# Altium project ACTIVIEW-HEADSET-PCB.PrjPcb
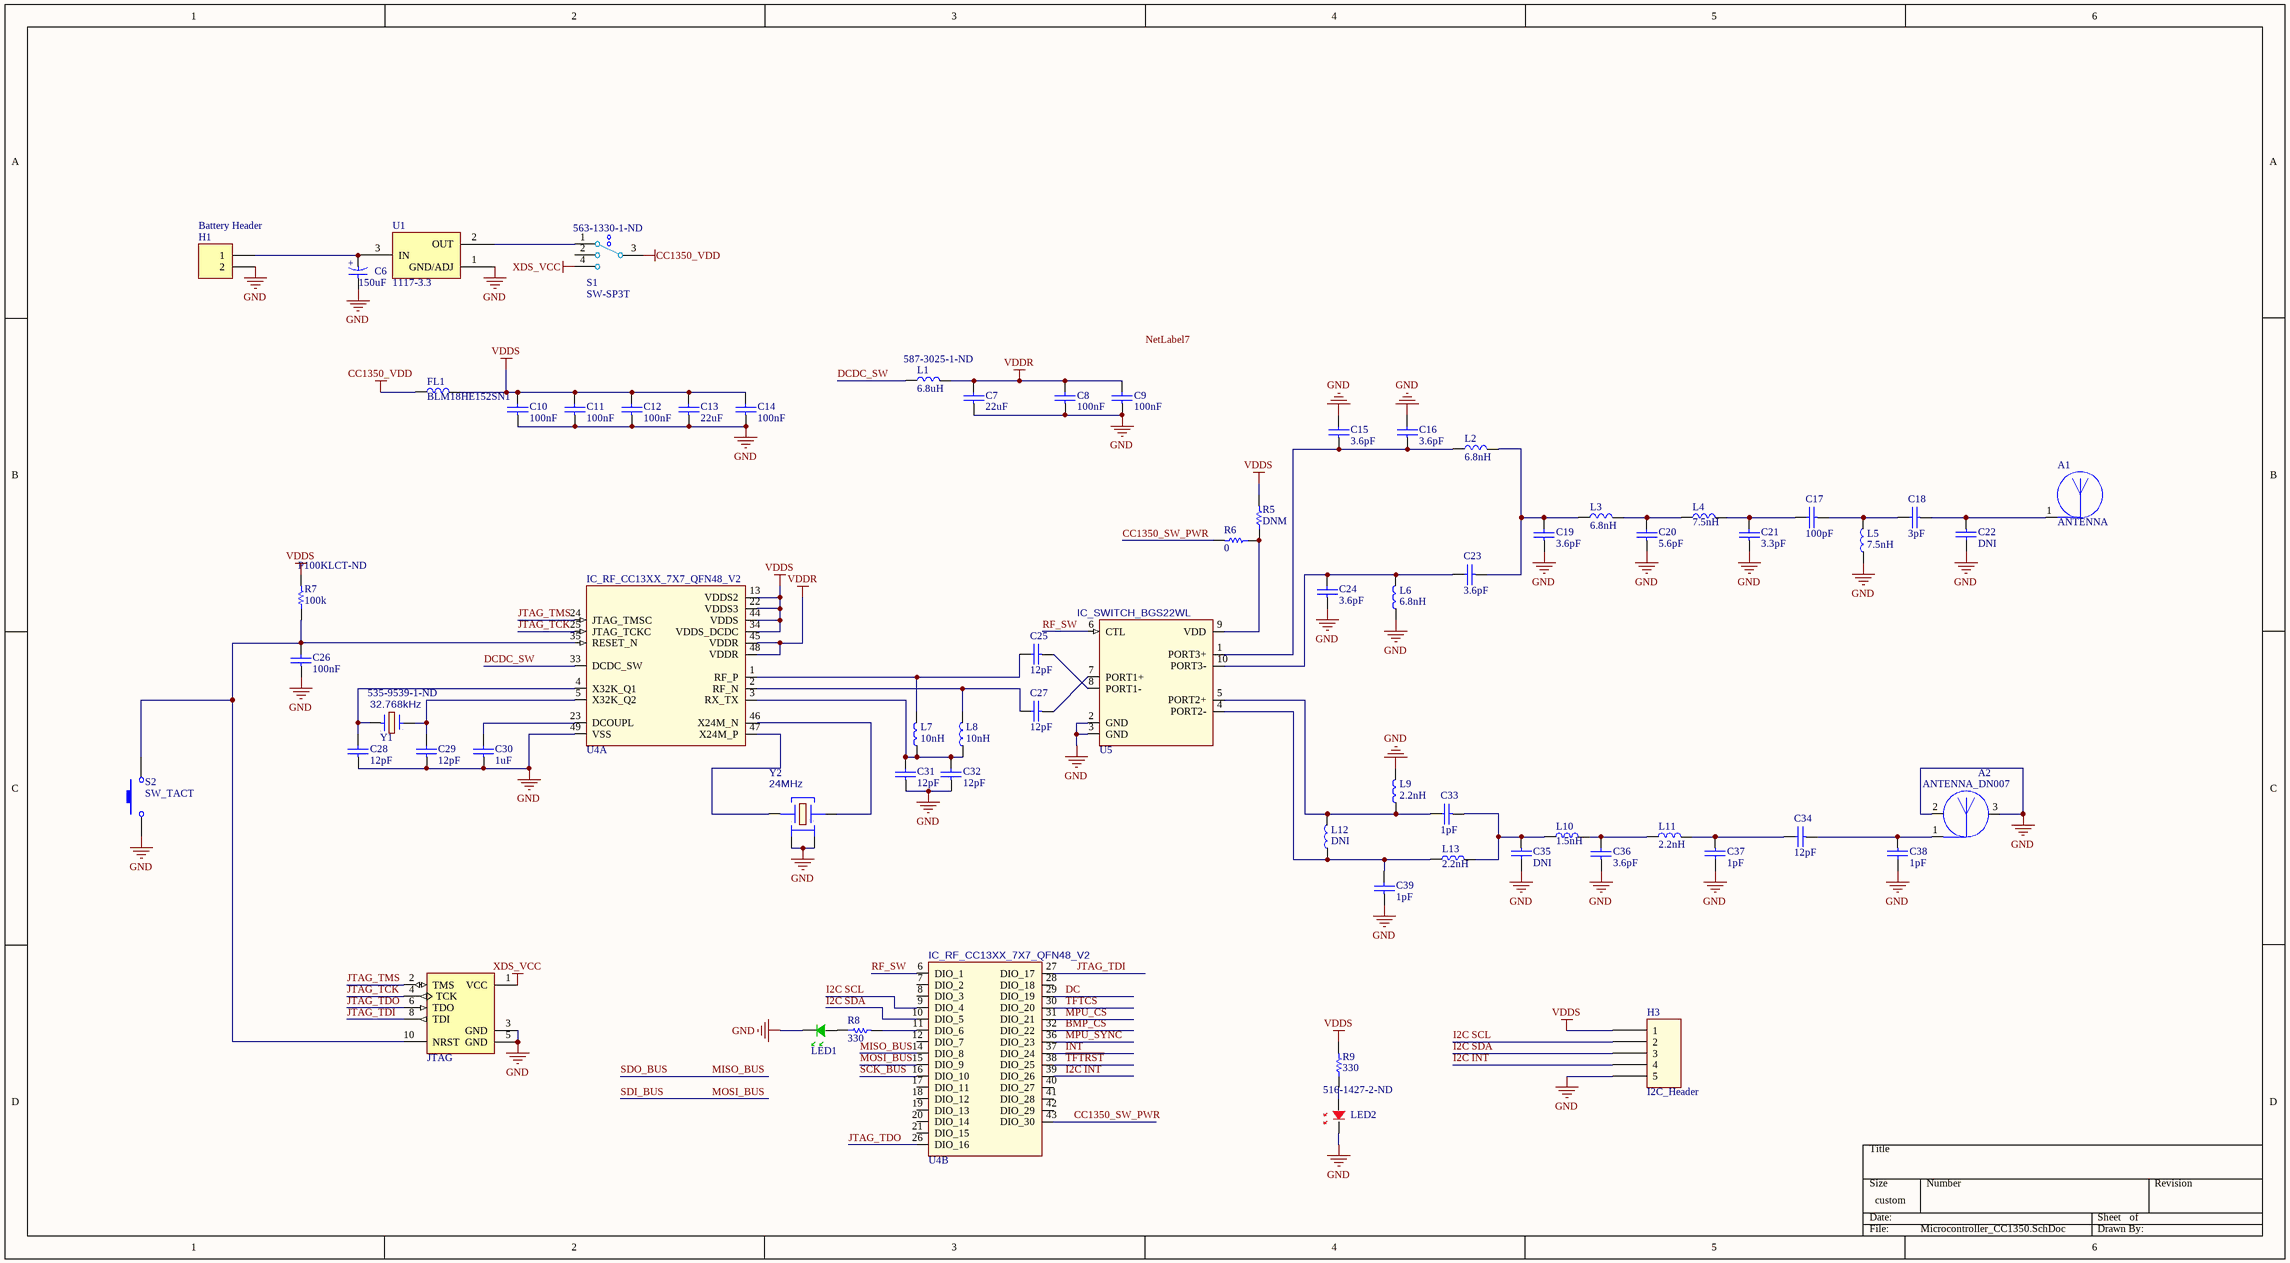
[diagram p0: Microcontroller_CC1350.SchDoc]
4 sheets, 75 parts. Net scope: global (net labels, ports and power ports of the same name join across sheets).
Board file: HEADSET-PCB.PcbDoc
Sheets:
  Microcontroller_CC1350.SchDoc
  IMU_MPU9250.SchDoc
  Pressure_BMP280.SchDoc
  LCD_Display.SchDoc

## Sheet Microcontroller_CC1350.SchDoc
size 508 x 279 mm

### Parts
A1  ANTENNA  [Sub-1GHz-Antenna]
A2  ANTENNA_DN007  [Inverted_F_Antenna]
C6  150uF  [2312 [IMP] Polar]
C7  22uF  [0603[IMP]]
C8  100nF  [0402[IMP]]
C9  100nF  [0402[IMP]]
C10  100nF  [0402[IMP]]
C11  100nF  [0402[IMP]]
C12  100nF  [0402[IMP]]
C13  22uF  [0603[IMP]]
C14  100nF  [0402[IMP]]
C15  3.6pF  [0402[IMP]]
C16  3.6pF  [0402[IMP]]
C17  100pF  [0402[IMP]]
C18  3pF  [0402[IMP]]
C19  3.6pF  [0402[IMP]]
C20  5.6pF  [0402[IMP]]
C21  3.3pF  [0402[IMP]]
C22  DNI  [0402[IMP]]
C23  3.6pF  [0402[IMP]]
C24  3.6pF  [0402[IMP]]
C25  12pF  [0402[IMP]]
C26  100nF  [0402[IMP]]
C27  12pF  [0402[IMP]]
C28  12pF  [0402[IMP]]
C29  12pF  [0402[IMP]]
C30  1uF  [0402[IMP]]
C31  12pF  [0402[IMP]]
C32  12pF  [0402[IMP]]
C33  1pF  [0402[IMP]]
C34  12pF  [0402[IMP]]
C35  DNI  [0402[IMP]]
C36  3.6pF  [0402[IMP]]
C37  1pF  [0402[IMP]]
C38  1pF  [0402[IMP]]
C39  1pF  [0402[IMP]]
FL1  BLM18HE152SN1  [0603[IMP]]
H1  Battery Header  [S2B-PH-SM4-TB]
H2  JTAG  [HDR-2*5-0.05_Without_Through_Hole]
H3  I2C_Header  [I2C_Header]
L1  Supplier Part Number 1: 587-3025-1-ND  [0805[IMP]]  (hidden comment: 6.8uH)
L2  6.8nH  [0402[IMP]]
L3  6.8nH  [0402[IMP]]
L4  7.5nH  [0402[IMP]]
L5  7.5nH  [0402[IMP]]
L6  6.8nH  [0402[IMP]]
L7  10nH  [0402[IMP]]
L8  10nH  [0402[IMP]]
L9  2.2nH  [0402[IMP]]
L10  1.5nH  [0402[IMP]]
L11  2.2nH  [0402[IMP]]
L12  DNI  [0402[IMP]]
L13  2.2nH  [0402[IMP]]
LED1  LEDG  [0805[IMP] - POLAR]  (value not drawn)
LED2  Supplier Part Number 1: 516-1427-2-ND  [0805[IMP] - POLAR]  (hidden comment: LEDR)
R5  DNM  [0402[IMP]]
R6  0  [0402[IMP]]
R7  100k  Supplier Part Number 1: P100KLCT-ND  [0402[IMP]]
R8  330  [0402[IMP]]
R9  330  [0402[IMP]]
S1  SW-SP3T  Supplier Part Number 1: 563-1330-1-ND  [CL-SB-13B]
S2  SW_TACT  [PTS645SH50SMTR92_LFS]
U1  1117-3.3  [SOT-223]
U4  IC_RF_CC13XX_7X7_QFN48_V2  [RGZ(S-PVQFN-N48) - duplicate]  (parts A,B of 2)
U5  IC_SWITCH_BGS22WL  [TSLP-10-1]
Y1  32.768kHz  Supplier Part Number 1: 535-9539-1-ND  [FC-135]
Y2  24MHz  [TSX-3225]

### Nets
CC1350_VDD: FL1.1 S1.3
GND: A2.2(GND_2) A2.3(GND_3) C6.1 C7.2 C8.2 C9.2 C10.2 C11.2 C12.2 C13.2 C14.2 C15.1 C16.1 C19.2 C20.2 C21.2 C22.1 C24.2 C26.2 C28.2 C29.2 C30.2 C31.2 C32.2 C35.1 C36.2 C37.1 C38.1 C39.2 H1.2 H2.3(GND) H2.5(GND) H3.5 L5.1 L6.1 L9.2 LED1.2(K) LED2.2(K) S2.1 U1.1(GND/ADJ) U4.49(VSS) U5.2(GND) U5.3(GND) Y2.2 Y2.4
VDDR: C7.1 C8.1 C9.1 L1.2 U4.45(VDDR) U4.48(VDDR)
VDDS: C10.1 C11.1 C12.1 C13.1 C14.1 FL1.2 H3.1 R5.2 R7.2 R9.2 U4.13(VDDS2) U4.22(VDDS3) U4.34(VDDS_DCDC) U4.44(VDDS)
XDS_VCC: H2.1(VCC) S1.4
BMP_CS: U4.32(DIO_22)
CC1350_SW_PWR: R6.2 U4.43(DIO_30)
DC: U4.29(DIO_19)
DCDC_SW: L1.1 U4.33(DCDC_SW)
I2C INT: H3.4 U4.39(DIO_26)
I2C SCL: H3.2 U4.9(DIO_4)
I2C SDA: H3.3 U4.10(DIO_5)
INT: U4.37(DIO_24)
JTAG_TCK: H2.4(TCK) U4.25(JTAG_TCKC)
JTAG_TDI: H2.8(TDI) U4.27(DIO_17)
JTAG_TDO: H2.6(TDO) U4.26(DIO_16)
JTAG_TMS: H2.2(TMS) U4.24(JTAG_TMSC)
MISO_BUS: U4.14(DIO_8)  [also labelled SDO_BUS]
MOSI_BUS: U4.15(DIO_9)  [also labelled SDI_BUS]
MPU_CS: U4.31(DIO_21)
MPU_SYNC: U4.36(DIO_23)
RF_SW: U4.6(DIO_1) U5.6(CTL)
SCK_BUS: U4.16(DIO_10)
~{TFTRST}: U4.38(DIO_25)
TFTCS: U4.30(DIO_20)
NetA1_1: A1.1(FEED/GND_1) C18.2 C22.2
NetA2_1: A2.1(FEED_1) C34.2 C38.2
NetC6_2: C6.2 H1.1 U1.3(IN)
NetC15_2: C15.2 C16.2 L2.1 U5.1(PORT3+)
NetC17_1: C17.1 C21.1 L4.2
NetC17_2: C17.2 C18.1 L5.2
NetC19_1: C19.1 C23.2 L2.2 L3.1
NetC20_1: C20.1 L3.2 L4.1
NetC23_1: C23.1 C24.1 L6.2 U5.10(PORT3-)
NetC25_1: C25.1 L7.2 U4.1(RF_P)
NetC25_2: C25.2 U5.8(PORT1-)
NetC26_1: C26.1 H2.10(NRST) R7.1 S2.2 U4.35(RESET_N)
NetC27_1: C27.1 L8.2 U4.2(RF_N)
NetC27_2: C27.2 U5.7(PORT1+)
NetC28_1: C28.1 U4.4(X32K_Q1) Y1.1
NetC29_1: C29.1 U4.5(X32K_Q2) Y1.2
NetC30_1: C30.1 U4.23(DCOUPL)
NetC31_1: C31.1 C32.1 L7.1 L8.1 U4.3(RX_TX)
NetC33_1: C33.1 L9.1 L12.2 U5.5(PORT2+)
NetC33_2: C33.2 C35.2 L10.1 L13.2
NetC34_1: C34.1 C37.2 L11.2
NetC36_1: C36.1 L10.2 L11.1
NetC39_1: C39.1 L12.1 L13.1 U5.4(PORT2-)
NetLED1_1: LED1.1(A) R8.1
NetLED2_1: LED2.1(A) R9.1
NetR5_1: R5.1 R6.1 U5.9(VDD)
NetR8_2: R8.2 U4.11(DIO_6)
NetS1_1: S1.1 U1.2(OUT)
NetU4_46: U4.46(X24M_N) Y2.3
NetU4_47: U4.47(X24M_P) Y2.1

Not connected (* = marked no-connect by the designer): S1 2; U4 7(DIO_2) 8(DIO_3) 12(DIO_7) 17(DIO_11) 18(DIO_12) 19(DIO_13) 20(DIO_14) 21(DIO_15) 28(DIO_18) 40(DIO_27) 41(DIO_28) 42(DIO_29)

### Notes on the sheet
- Labels drawn without touching a wire or pin: NetLabel7
- (in symbol Cap_E) +

### Library data of the parts
A1 = ANTENNA: Designed by: Pawel Kwaskiewicz; CLASS: DISCRETE; Design date: 2010-02-22
A2 = ANTENNA_DN007: Designed by: Artur Bielinski; Design date: 2011-09-19
C6 = Cap_E: Capacitor; Value: 150uF; Supplier 1: Digi-Key; Supplier Part Number 1: 478-3481-1-ND
C7-C39 = CAPACITOR: VOLTAGE: CMAX; CURRENT: CIMAX; KNEE: CBMAX; PSpiceTemplate: C^@REFDES %1 %2 ?TOLERANCE|C^@REFDES| @VALUE ?IC/IC=@IC/ TC=@TC1,@TC2 ?TOLERANCE|\n.model C^@REFDES CAP C=1 DEV=@TOLERANCE%|; DIST: FLAT; SLOPE: CSMAX; MAX_TEMP: CTMAX; TC1: 0; CLASS: DISCRETE; TC2: 0
  C7 C13: Value: 22uF; Supplier 1: Digi-Key; Supplier Part Number 1: 490-7611-1-ND
  C8-C12 C14 C26: Value: 100nF; Supplier 1: Digi-Key; Supplier Part Number 1: 490-6327-1-ND
  C15 C19 C23 C24 C36: Value: 3.6pF; Supplier 1: Digi-Key; Supplier Part Number 1: 490-5939-1-ND
  C16: Value: 3.6pF; Supplier 1: Digi-Key; Supplier Part Number 1: 399-14982-1-ND; Supplier 2: Digi-Key; Supplier Part Number 2: 490-5939-1-ND
  C17: Value: 100pF; Supplier 1: Digi-Key; Supplier Part Number 1: 490-7753-1-ND
  C18: Value: 3pF; Supplier 1: Digi-Key; Supplier Part Number 1: 712-1282-1-ND
  C20: Value: 5.6pF; Supplier 1: Digi-Key; Supplier Part Number 1: 490-6250-1-ND
  C21: Value: 3.3pF; Supplier 1: Digi-Key; Supplier Part Number 1: 490-5938-1-ND
  C22 C35: Value: DNI
  C25 C27-C29 C31 C32: Value: 12pF; Supplier 1: Digi-Key; Supplier Part Number 1: 399-1013-1-ND
  C30: Value: 1uF; Supplier 1: Digi-Key; Supplier Part Number 1: 1276-1448-1-ND
  C33 C37-C39: Value: 1pF; Supplier 1: Digi-Key; Supplier Part Number 1: 490-3199-1-ND
  C34: Value: 12pF; Supplier 1: Digi-Key; Supplier Part Number 1: 490-5924-1-ND
FL1 L1-L13 = INDUCTOR: Current: LMAX; PSpiceTemplate: L^@REFDES %1 %2 ?TOLERANCE|L^@REFDES| @VALUE ?IC/IC=@IC/ ?TOLERANCE|\n.model l^@REFDES IND L=1 DEV=@TOLERANCE%|; DIELECTRIC: DSMAX; DIST: FLAT
  FL1: Value: BLM18HE152SN1; Supplier 1: Digi-Key; Supplier Part Number 1: 490-5216-1-ND
  L1: Value: 6.8uH; Supplier 1: Digi-Key
  L2 L6: Value: 6.8nH; Supplier 1: Digi-Key; Supplier Part Number 1: 712-1419-1-ND
  L3: Value: 6.8nH; Supplier 1: Digi-Key; Supplier Part Number 1: 587-1543-1-ND
  L4 L5: Value: 7.5nH; Supplier 1: Digi-Key; Supplier Part Number 1: 490-3456-1-ND
  L7 L8: Value: 10nH; Supplier 1: Digi-Key; Supplier Part Number 1: 712-1407-1-ND
  L9 L11 L13: Value: 2.2nH; Supplier 1: Digi-Key; Supplier Part Number 1: 490-6794-1-ND
  L10: Value: 1.5nH; Supplier 1: Digi-Key; Supplier Part Number 1: 490-6783-1-ND
  L12: Value: DNI
H1 = Header 2: Supplier 1: Digi-Key; Supplier Part Number 1: 455-1749-1-ND
H2 = JTAG-ARM: USB JTAG Programmer; Supplier 1: Digi-Key; Supplier Part Number 1: SAM13160CT-ND
LED1 = LED_G: LED; Value: ?; Supplier 1: Digi-Key; Supplier 2: Digi-Key; Supplier Part Number 2: 475-1410-1-ND
LED2 = LED_R: LED; Value: ?; Supplier 1: Digi-Key
R5-R9 = RESISTOR
  R5: Value: DNM
  R6: Value: 0; Supplier 1: Digi-Key; Supplier Part Number 1: 541-0.0YBCT-ND
  R7: Value: 100k; Supplier 1: Digi-Key
  R8 R9: Value: 330; Supplier 1: Digi-Key; Supplier Part Number 1: P330LCT-ND
S2 = SW_TACT: Tactile switch; Supplier 1: Digi-Key; Supplier Part Number 1: CKN9085CT-ND
U1 = 1117-3.3V: 3.3V Voltage Regulator; Supplier 1: Digi-Key; Supplier Part Number 1: LM1117IMPX-3.3/NOPBCT-ND
U4 = IC_RF_CC13XX_7X7_QFN48_V2: Designed_By: Artur Bielinski; SPLIT_INST: TRUE; SWAP_INFO: (S1+S2); Design_Date: 2014-09-04; Supplier 1: Digi-Key; Supplier Part Number 1: 296-44716-1-ND
U5 = IC_SWITCH_XMSSJE3G0PA-00: CLASS: IC; Designed_By: Artur Bielinski; Design_Date: 2015-06-03; Supplier 1: Digi-Key; Supplier Part Number 1: BGS22WL10E6327XTSA1CT-ND
Y1 = CRYSTAL: Supplier 1: Digi-Key
Y2 = XTAL_4PIN_S: Supplier 1: Digi-Key; Supplier Part Number 1: SER3635CT-ND
S1 = SW-SP3T: Supplier 1: Digi-Key

## Sheet IMU_MPU9250.SchDoc
size 203 x 127 mm
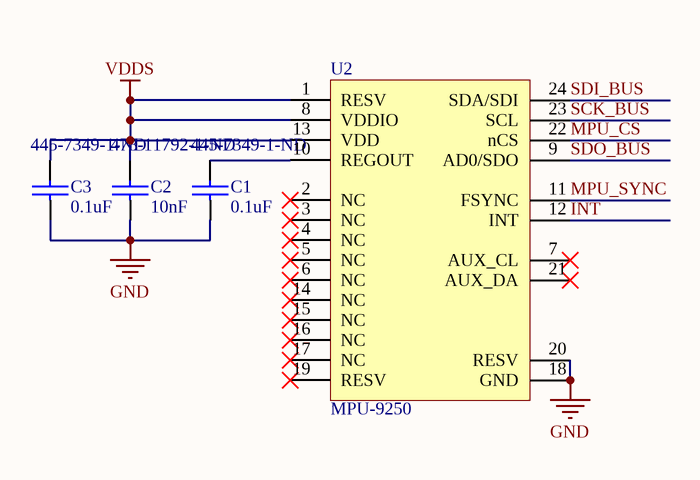
[diagram p1: IMU_MPU9250.SchDoc]

### Parts
C1  Supplier Part Number 1: 445-7349-1-ND  [0402[IMP]]  (hidden comment: 0.1uF)
C2  Supplier Part Number 1: 478-11792-1-ND  [0402[IMP]]  (hidden comment: 10nF)
C3  Supplier Part Number 1: 445-7349-1-ND  [0402[IMP]]  (hidden comment: 0.1uF)
U2  MPU-9250  [QFN-24-3mmx3mm]

### Nets
GND: C1.2 C2.2 C3.2 U2.18(GND) U2.20(RESV)
VDDS: C2.1 C3.1 U2.1(RESV) U2.8(VDDIO) U2.13(VDD)
INT: U2.12(INT)
MPU_CS: U2.22(nCS)
MPU_SYNC: U2.11(FSYNC)
SCK_BUS: U2.23(SCL)
SDI_BUS: U2.24(SDA/SDI)  [project net MOSI_BUS]
SDO_BUS: U2.9(AD0/SDO)  [project net MISO_BUS]
NetC1_1: C1.1 U2.10(REGOUT)

Not connected (* = marked no-connect by the designer): U2 2(NC)* 3(NC)* 4(NC)* 5(NC)* 6(NC)* 7(AUX_CL)* 14(NC)* 15(NC)* 16(NC)* 17(NC)* 19(RESV)* 21(AUX_DA)*

### Library data of the parts
C1-C3 = CAPACITOR: as C7 on sheet Microcontroller_CC1350; TC2: 0; Supplier 1: Digi-Key
  C1 C3: Value: 0.1uF
  C2: Value: 10nF

## Sheet Pressure_BMP280.SchDoc: BMP280
size 203 x 127 mm
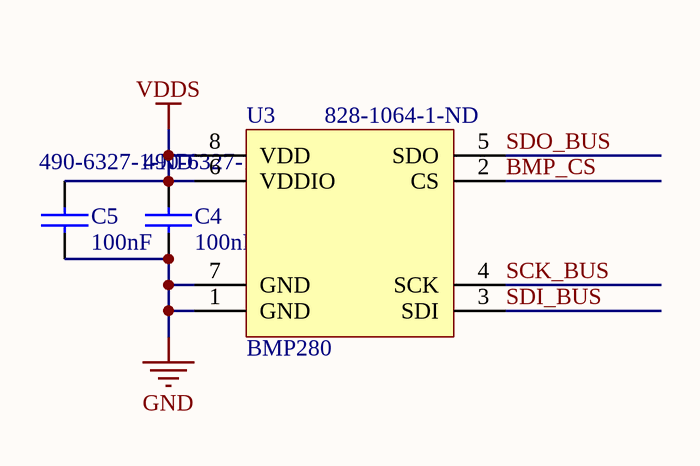
[diagram p2: Pressure_BMP280.SchDoc]

### Parts
C4  Supplier Part Number 1: 490-6327-1-ND  [0402[IMP]]  (hidden comment: 100nF)
C5  Supplier Part Number 1: 490-6327-1-ND  [0402[IMP]]  (hidden comment: 100nF)
U3  BMP280  Supplier Part Number 1: 828-1064-1-ND  [LGA-8]

### Nets
GND: C4.2 C5.2 U3.1(GND) U3.7(GND)
VDDS: C4.1 C5.1 U3.6(VDDIO) U3.8(VDD)
BMP_CS: U3.2(CS)
SCK_BUS: U3.4(SCK)
SDI_BUS: U3.3(SDI)  [project net MOSI_BUS]
SDO_BUS: U3.5(SDO)  [project net MISO_BUS]

### Library data of the parts
C4 C5 = CAPACITOR: as C7 on sheet Microcontroller_CC1350; TC2: 0; Value: 100nF; Supplier 1: Digi-Key
U3 = BMP280: Supplier 1: Digi-Key

## Sheet LCD_Display.SchDoc
size A
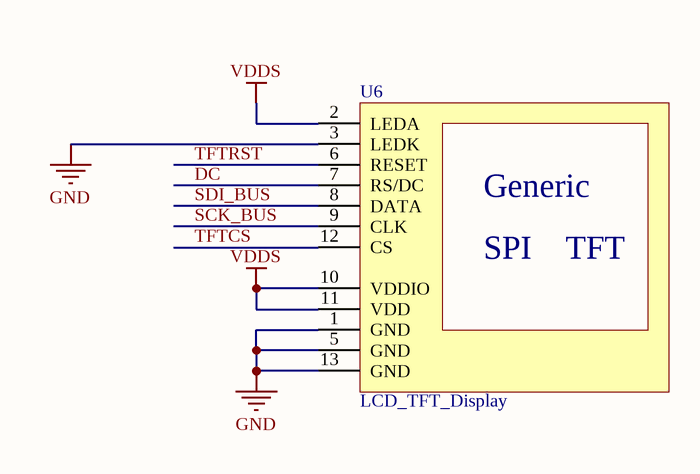
[diagram p3: LCD_Display.SchDoc]

### Parts
U6  LCD_TFT_Display  [LCD_Ribbon]

### Nets
GND: U6.1(GND) U6.3(LEDK) U6.5(GND) U6.13(GND)
VDDS: U6.2(LEDA) U6.10(VDDIO) U6.11(VDD)
DC: U6.7(RS/DC)
SCK_BUS: U6.9(CLK)
SDI_BUS: U6.8(DATA)  [project net MOSI_BUS]
~{TFTRST}: U6.6(RESET)
TFTCS: U6.12(CS)

### Notes on the sheet
- (in symbol LCD_TFT_Display) Generic; SPI    TFT

## Nets that join several sheets
GND: Microcontroller_CC1350 (45 pins), IMU_MPU9250 (5 pins), Pressure_BMP280 (C4.2 C5.2 U3.1 U3.7), LCD_Display (U6.1 U6.3 U6.5 U6.13)
VDDS: Microcontroller_CC1350 (14 pins), IMU_MPU9250 (5 pins), Pressure_BMP280 (C4.1 C5.1 U3.6 U3.8), LCD_Display (U6.2 U6.10 U6.11)
BMP_CS: Microcontroller_CC1350 (U4.32), Pressure_BMP280 (U3.2)
DC: Microcontroller_CC1350 (U4.29), LCD_Display (U6.7)
INT: Microcontroller_CC1350 (U4.37), IMU_MPU9250 (U2.12)
MISO_BUS: Microcontroller_CC1350 (U4.14), IMU_MPU9250 (U2.9), Pressure_BMP280 (U3.5)
MOSI_BUS: Microcontroller_CC1350 (U4.15), IMU_MPU9250 (U2.24), Pressure_BMP280 (U3.3), LCD_Display (U6.8)
MPU_CS: Microcontroller_CC1350 (U4.31), IMU_MPU9250 (U2.22)
MPU_SYNC: Microcontroller_CC1350 (U4.36), IMU_MPU9250 (U2.11)
SCK_BUS: Microcontroller_CC1350 (U4.16), IMU_MPU9250 (U2.23), Pressure_BMP280 (U3.4), LCD_Display (U6.9)
~{TFTRST}: Microcontroller_CC1350 (U4.38), LCD_Display (U6.6)
TFTCS: Microcontroller_CC1350 (U4.30), LCD_Display (U6.12)